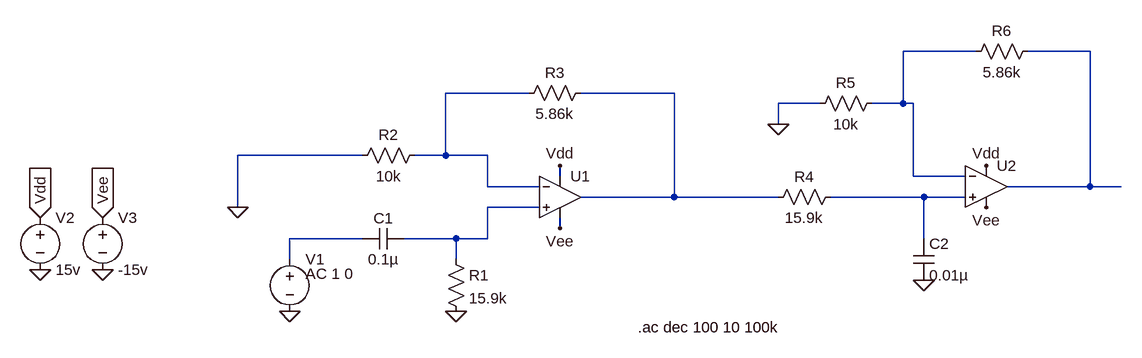
[diagram p0: schematic Draft2.asc]
Draft2.asc, the LTspice schematic file:
Version 4
SHEET 1 1396 680
WIRE 1168 -32 1056 -32
WIRE 1344 -32 1248 -32
WIRE 480 32 352 32
WIRE 704 32 560 32
WIRE 928 48 864 48
WIRE 1056 48 1056 -32
WIRE 1056 48 1008 48
WIRE 1072 48 1056 48
WIRE 864 80 864 48
WIRE 224 128 32 128
WIRE 352 128 352 32
WIRE 352 128 304 128
WIRE 416 128 352 128
WIRE 528 160 528 144
WIRE 1072 160 1072 48
WIRE 1152 160 1072 160
WIRE 416 176 416 128
WIRE 496 176 416 176
WIRE 1344 176 1344 -32
WIRE 1344 176 1216 176
WIRE 1392 176 1344 176
WIRE 704 192 704 32
WIRE 704 192 560 192
WIRE 864 192 704 192
WIRE 1088 192 944 192
WIRE 1152 192 1088 192
WIRE 32 208 32 128
WIRE 496 208 416 208
WIRE 528 240 528 224
WIRE 224 256 112 256
WIRE 368 256 288 256
WIRE 416 256 416 208
WIRE 416 256 368 256
WIRE 1088 256 1088 192
WIRE 112 288 112 256
WIRE 368 288 368 256
FLAG 32 208 0
FLAG -272 304 0
FLAG -176 304 0
FLAG -272 224 Vdd
IOPIN -272 224 In
FLAG -176 224 Vee
IOPIN -176 224 In
FLAG 528 144 Vdd
FLAG 528 240 Vee
FLAG 112 368 0
FLAG 368 368 0
FLAG 1088 320 0
FLAG 864 80 0
FLAG 1184 144 Vdd
FLAG 1184 208 Vee
SYMBOL Voltage 112 272 R0
WINDOW 123 24 38 Left 2
SYMATTR InstName V1
SYMATTR Value ""
SYMATTR Value2 AC 1 0
SYMBOL Voltage -272 208 R0
SYMATTR InstName V2
SYMATTR Value 15v
SYMBOL Voltage -176 208 R0
SYMATTR InstName V3
SYMATTR Value -15v
SYMBOL Cap 288 240 R90
WINDOW 0 0 32 VBottom 2
WINDOW 3 32 32 VTop 2
SYMATTR InstName C1
SYMATTR Value 0.1µ
SYMBOL Res 352 272 R0
SYMATTR InstName R1
SYMATTR Value 15.9k
SYMBOL Res 320 112 R90
WINDOW 0 0 56 VBottom 2
WINDOW 3 32 56 VTop 2
SYMATTR InstName R2
SYMATTR Value 10k
SYMBOL OpAmps/UniversalOpAmp 528 192 R0
SYMATTR InstName U1
SYMBOL Res 576 16 R90
WINDOW 0 0 56 VBottom 2
WINDOW 3 32 56 VTop 2
SYMATTR InstName R3
SYMATTR Value 5.86k
SYMBOL Res 960 176 R90
WINDOW 0 0 56 VBottom 2
WINDOW 3 32 56 VTop 2
SYMATTR InstName R4
SYMATTR Value 15.9k
SYMBOL Cap 1072 256 R0
SYMATTR InstName C2
SYMATTR Value 0.01µ
SYMBOL OpAmps/UniversalOpAmp 1184 176 R0
SYMATTR InstName U2
SYMBOL Res 1024 32 R90
WINDOW 0 0 56 VBottom 2
WINDOW 3 32 56 VTop 2
SYMATTR InstName R5
SYMATTR Value 10k
SYMBOL Res 1264 -48 R90
WINDOW 0 0 56 VBottom 2
WINDOW 3 32 56 VTop 2
SYMATTR InstName R6
SYMATTR Value 5.86k
TEXT 648 392 Left 2 !.ac dec 100 10 100k

The netlist it stands for:
* Draft2.asc
V1 N007 0 AC 1 0
V2 Vdd 0 15v
V3 Vee 0 -15v
C1 N006 N007 0.1µ
R1 N006 0 15.9k
R2 N003 0 10k
XU1 N006 N003 Vdd Vee N004 level1 Avol=1Meg GBW=10Meg Vos=0 En=0 Enk=0 In=0 Ink=0 Rin=500Meg  ; pins In+ In- V+ V- OUT
R3 N004 N003 5.86k
R4 N005 N004 15.9k
C2 N005 0 0.01µ
XU2 N005 N001 Vdd Vee N002 level1 Avol=1Meg GBW=10Meg Vos=0 En=0 Enk=0 In=0 Ink=0 Rin=500Meg  ; pins In+ In- V+ V- OUT
R5 N001 0 10k
R6 N002 N001 5.86k
.ac dec 100 10 100k
.lib UniversalOpAmp1.lib
.backanno
.end